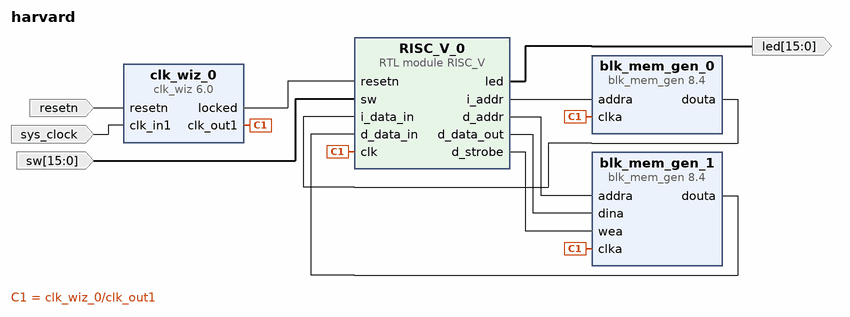
[diagram p0: block diagram of the top level]
# Vivado block design harvard, xc7a100tcsg324-1, Vivado 2026.1
create_bd_design harvard

create_bd_port -dir I -type rst resetn
set_property -dict {CONFIG.POLARITY ACTIVE_LOW} [get_bd_ports resetn]
create_bd_port -dir I -type clk sys_clock
set_property -dict {CONFIG.FREQ_HZ 100000000 CONFIG.PHASE 0.0} [get_bd_ports sys_clock]
create_bd_port -dir I -from 15 -to 0 sw
create_bd_port -dir O -from 15 -to 0 led

create_bd_cell -type module -reference RISC_V RISC_V_0
create_bd_cell -type ip -vlnv xilinx.com:ip:clk_wiz:6.0 clk_wiz_0
set_property -dict [list \
  CONFIG.CLKIN2_JITTER_PS 166.24 \
  CONFIG.CLKOUT1_JITTER 122.344 \
  CONFIG.CLKOUT1_PHASE_ERROR 97.646 \
  CONFIG.CLKOUT1_REQUESTED_OUT_FREQ 135 \
  CONFIG.CLK_IN1_BOARD_INTERFACE sys_clock \
  CONFIG.ENABLE_CLOCK_MONITOR false \
  CONFIG.JITTER_SEL No_Jitter \
  CONFIG.MMCM_BANDWIDTH OPTIMIZED \
  CONFIG.MMCM_CLKFBOUT_MULT_F 10.125 \
  CONFIG.MMCM_CLKIN2_PERIOD 10.000 \
  CONFIG.MMCM_CLKOUT0_DIVIDE_F 7.500 \
  CONFIG.MMCM_DIVCLK_DIVIDE 1 \
  CONFIG.PRIMITIVE MMCM \
  CONFIG.RESET_BOARD_INTERFACE reset \
  CONFIG.RESET_PORT resetn \
  CONFIG.RESET_TYPE ACTIVE_LOW \
  CONFIG.SECONDARY_SOURCE Single_ended_clock_capable_pin \
  CONFIG.USE_BOARD_FLOW true \
  CONFIG.USE_INCLK_SWITCHOVER false \
  CONFIG.USE_LOCKED true \
  CONFIG.USE_RESET true \
] [get_bd_cells clk_wiz_0]
create_bd_cell -type ip -vlnv xilinx.com:ip:blk_mem_gen:8.4 blk_mem_gen_0
set_property -dict [list \
  CONFIG.Coe_File ../../../../../../cylon_test/cylon_test/cylon_test.coe \
  CONFIG.Enable_32bit_Address false \
  CONFIG.Enable_A Always_Enabled \
  CONFIG.Load_Init_File true \
  CONFIG.Memory_Type Single_Port_ROM \
  CONFIG.Port_A_Write_Rate 0 \
  CONFIG.Register_PortA_Output_of_Memory_Core false \
  CONFIG.Register_PortA_Output_of_Memory_Primitives true \
  CONFIG.Use_RSTA_Pin false \
  CONFIG.Write_Depth_A 1024 \
  CONFIG.use_bram_block Stand_Alone \
] [get_bd_cells blk_mem_gen_0]
create_bd_cell -type ip -vlnv xilinx.com:ip:blk_mem_gen:8.4 blk_mem_gen_1
set_property -dict [list \
  CONFIG.Byte_Size 8 \
  CONFIG.Enable_A Always_Enabled \
  CONFIG.Register_PortA_Output_of_Memory_Core false \
  CONFIG.Register_PortA_Output_of_Memory_Primitives false \
  CONFIG.Use_Byte_Write_Enable true \
  CONFIG.Use_RSTA_Pin false \
  CONFIG.Write_Depth_A 1024 \
  CONFIG.Write_Width_A 32 \
  CONFIG.use_bram_block Stand_Alone \
] [get_bd_cells blk_mem_gen_1]

# ---- connections ----

connect_bd_net [get_bd_pins RISC_V_0/d_addr] [get_bd_pins blk_mem_gen_1/addra]
connect_bd_net [get_bd_pins RISC_V_0/d_data_out] [get_bd_pins blk_mem_gen_1/dina]
connect_bd_net [get_bd_pins RISC_V_0/d_strobe] [get_bd_pins blk_mem_gen_1/wea]
connect_bd_net [get_bd_pins RISC_V_0/i_addr] [get_bd_pins blk_mem_gen_0/addra]
connect_bd_net [get_bd_pins RISC_V_0/led] [get_bd_ports led]
connect_bd_net [get_bd_pins blk_mem_gen_0/douta] [get_bd_pins RISC_V_0/i_data_in]
connect_bd_net [get_bd_pins blk_mem_gen_1/douta] [get_bd_pins RISC_V_0/d_data_in]
connect_bd_net [get_bd_pins clk_wiz_0/clk_out1] [get_bd_pins blk_mem_gen_1/clka] [get_bd_pins RISC_V_0/clk] [get_bd_pins blk_mem_gen_0/clka]
connect_bd_net [get_bd_pins clk_wiz_0/locked] [get_bd_pins RISC_V_0/resetn]
connect_bd_net -net reset_1 [get_bd_ports resetn] [get_bd_pins clk_wiz_0/resetn]
connect_bd_net [get_bd_ports sw] [get_bd_pins RISC_V_0/sw]
connect_bd_net [get_bd_ports sys_clock] [get_bd_pins clk_wiz_0/clk_in1]

validate_bd_design
save_bd_design
